# Altium schematic sheet Sheet1-driver.SchDoc
size A4; SheetNumber: 1; SheetTotal: 2
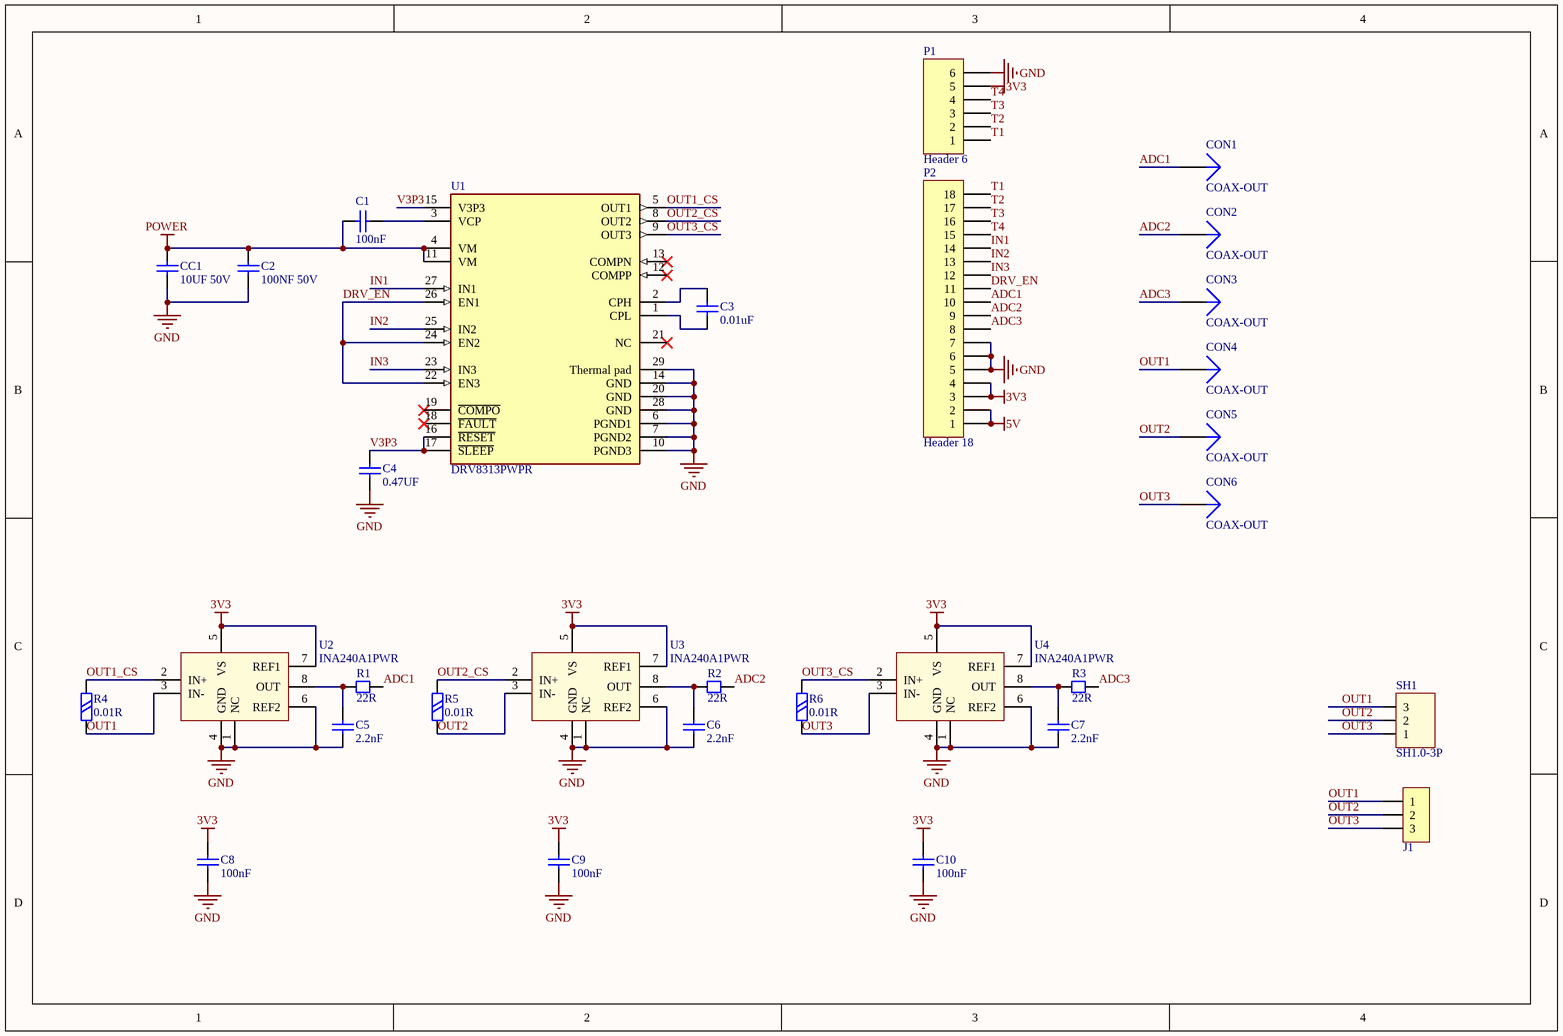
[diagram p0: Sheet1-driver.SchDoc]

## Parts
C1  100nF  [CC1608-0603]
C2  100NF 50V  [CC1608-0603]
C3  0.01uF  [CC1608-0603]
C4  0.47UF  [CC1608-0603]
C5  2.2nF  [CC1608-0603]
C6  2.2nF  [CC1608-0603]
C7  2.2nF  [CC1608-0603]
C8  100nF  [CC1608-0603]
C9  100nF  [CC1608-0603]
C10  100nF  [CC1608-0603]
CC1  value 10UF 50V  [CC3216-1206]  (hidden comment: Cap Chip 1206)
CON1  COAX-OUT  [PIN1]
CON2  COAX-OUT  [PIN1]
CON3  COAX-OUT  [PIN1]
CON4  COAX-OUT  [PIN1]
CON5  COAX-OUT  [PIN1]
CON6  COAX-OUT  [PIN1]
J1  HDR-1X3  [KF301-5.0-3P]  (value not drawn)
P1  Header 6  [HDR1X6]
P2  Header 18  [HDR1X18]
R1  22R  [CR1608-0603]
R2  22R  [CR1608-0603]
R3  22R  [CR1608-0603]
R4  0.01R  [CR3216-1206]
R5  0.01R  [CR3216-1206]
R6  0.01R  [CR3216-1206]
SH1  SH1.0-3P  [SH1.0-3P]
U1  DRV8313PWPR  [HTSSOP-28]
U2  INA240A1PWR  [TSSOP-8]
U3  INA240A1PWR  [TSSOP-8]
U4  INA240A1PWR  [TSSOP-8]

## Nets
3V3: C8.2 C9.2 C10.2 P1.5 P2.3 P2.4 U2.5(VS) U2.7(REF1) U3.5(VS) U3.7(REF1) U4.5(VS) U4.7(REF1)
5V: P2.1 P2.2
GND: C2.2 C4.2 C5.1 C6.1 C7.1 C8.1 C9.1 C10.1 CC1.1 P1.6 P2.5 P2.6 P2.7 U1.6(PGND1) U1.7(PGND2) U1.10(PGND3) U1.14(GND) U1.20(GND) U1.28(GND) U1.29(Thermal_pad) U2.1(NC) U2.4(GND) U2.6(REF2) U3.1(NC) U3.4(GND) U3.6(REF2) U4.1(NC) U4.4(GND) U4.6(REF2)
POWER: C1.2 C2.1 CC1.2 U1.4(VM) U1.11(VM)
ADC1: CON1.1(A) P2.10 R1.1
ADC2: CON2.1(A) P2.9 R2.1
ADC3: CON3.1(A) P2.8 R3.1
DRV_EN: P2.11 U1.22(EN3) U1.24(EN2) U1.26(EN1)
IN1: P2.14 U1.27(IN1)
IN2: P2.13 U1.25(IN2)
IN3: P2.12 U1.23(IN3)
OUT1: CON4.1(A) J1.1 R4.1 SH1.3 U2.3(IN-)
OUT1_CS: R4.2 U1.5(OUT1) U2.2(IN+)
OUT2: CON5.1(A) J1.2 R5.1 SH1.2 U3.3(IN-)
OUT2_CS: R5.2 U1.8(OUT2) U3.2(IN+)
OUT3: CON6.1(A) J1.3 R6.1 SH1.1 U4.3(IN-)
OUT3_CS: R6.2 U1.9(OUT3) U4.2(IN+)
T1: P1.1 P2.18
T2: P1.2 P2.17
T3: P1.3 P2.16
T4: P1.4 P2.15
V3P3: C4.1 U1.15(V3P3) U1.16(~{RESET}) U1.17(~{SLEEP})
NetC1_1: C1.1 U1.3(VCP)
NetC3_1: C3.1 U1.2(CPH)
NetC3_2: C3.2 U1.1(CPL)
NetC5_2: C5.2 R1.2 U2.8(OUT)
NetC6_2: C6.2 R2.2 U3.8(OUT)
NetC7_2: C7.2 R3.2 U4.8(OUT)

Not connected (* = marked no-connect by the designer): U1 12(COMPP)* 13(COMPN)* 18(~{FAULT})* 19(~{COMPO})* 21(NC)*

## Library data of the parts
C1-C10 = Cap Chip 0603: 0603封装的电容; Published: 8-Jun-2000; Revision: July-2002: Re-released for DXP Platform.; Publisher: Altium Limited
CC1 = Cap Chip 1206: Polarized Capacitor (Radial); Published: 8-Jun-2000; Revision: July-2002: Re-released for DXP Platform.; Publisher: Altium Limited
CON1-CON6 = COAX-OUT: Coax-M Connector; Revision: 17-Jul-2002: Re-released for DXP Platform.; Publisher: Altium Limited
J1 = KF301 3P: 3P拧螺丝插件; BOM名称: 3P接插件; 版权归属: 封装库来自淘宝 ID：黄晶宝石; 学习资源: https://shop463601444.taobao.com
P1 = Header 6: Header, 6-Pin; LatestRevisionDate: 17-Jul-2002; LatestRevisionNote: Re-released for DXP Platform.; Publisher: Altium Limited
P2 = Header 18: Header, 18-Pin; LatestRevisionDate: 17-Jul-2002; LatestRevisionNote: Re-released for DXP Platform.; Publisher: Altium Limited
R1-R3 = Resistor Chip 0603: 0603封装电阻; Published: 8-Jun-2000; Revision: July-2002: Re-released for DXP Platform.; Publisher: Altium Limited
R4-R6 = Resistor Chip 1206: 1206封装电阻; Published: 8-Jun-2000; Revision: July-2002: Re-released for DXP Platform.; Publisher: Altium Limited
SH1 = SH1.0-3P: 间距为1mm的端子
U1 = DRV8313: 独立控制的半 H 桥驱动器,主要用于驱动一个三项无刷电机IC MOTOR DRIVER 8V-60V 28HTSSOP; Min Supply Voltage: 8V; Max Supply Voltage: 60V; Number of Outputs: 1; Output Current: 1.75A; Interface: Parallel; Logic Function: AND GATE; Min Operating Temperature: -40°C; Max Operating Temperature: 125°C; Mount: Surface Mount; Lead Free: Lead Free; Package Quantity: 2000; Number of Pins: 28; Case/Package: HTSSOP; Series: -; Packaging: Tape and Reel
U2-U4 = INA240A1PWR: 超精密电流检测放大器